# Altium schematic sheet BUTTON_LED.SchDoc
size A3; SheetNumber: 22; SheetTotal: 23
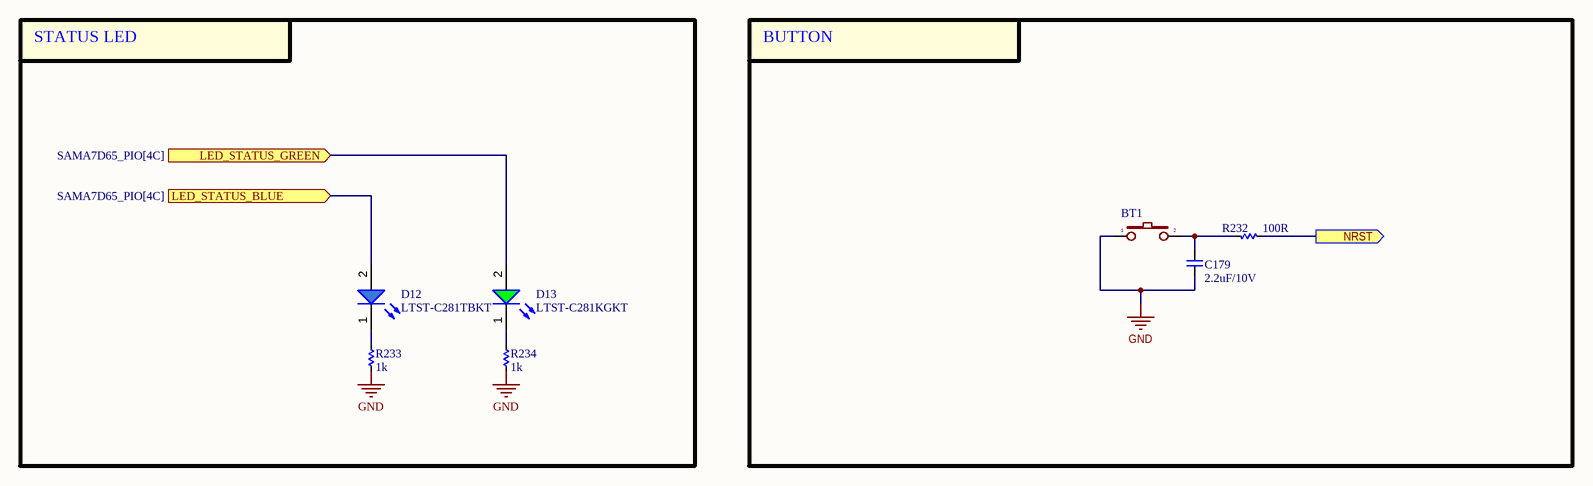
[diagram p0: BUTTON_LED.SchDoc]

## Parts
BT1  BT_  [SW2-SMD]  (value not drawn)
C179  2.2uF/10V  [CAP_C_1005X50_L]
D12  LTST-C281TBKT  [LED_0402]
D13  LTST-C281KGKT  [LED_0402]
R232  100R  [RES_C_1005x30_L]
R233  1k  [RES_C_1005x30_L]
R234  1k  [RES_C_1005x30_L]

## Blocks framed on the sheet
STATUS LED: D12 D13 R233 R234
BUTTON: BT1 C179 R232

## Ports
LED_STATUS_BLUE (in, see SAMA7D65_PIO[4C]), LED_STATUS_GREEN (in, see SAMA7D65_PIO[4C]), NRST (out, see SAMA7D65_MPU[1B], SAMA7D65_PMIC[1B], WATCHDOG[5B])

## Nets
GND: BT1.1 C179.1 R233.1 R234.1
LED_STATUS_BLUE: D12.2(A) ; port LED_STATUS_BLUE
LED_STATUS_GREEN: D13.2(A) ; port LED_STATUS_GREEN
NRST: R232.2 ; port NRST
NetBT1_2: BT1.2 C179.2 R232.1
NetD12_1: D12.1(K) R233.2
NetD13_1: D13.1(K) R234.2

## Notes on the sheet
- Project:
- Page Contents:
- Revision:
- Design:
- Date:
- Size:
- A3
- Document Number:
- Sheet:
- of

## Library data of the parts
BT1 = BT2: Switch button 2 pin; Value: SW chip 2 pin
C179 = _CAP_C_2: CAP CHIP
D12 = LED_BLUE
D13 = LED_GREEN: LED GREEN CLEAR 0402 SMD
R232-R234 = _RES_B_2: RES